# Altium schematic sheet OMT_Speaker_Pwm.SchDoc
size A; Organization: Altium Limited; Address1: L3, 12a Rodborough Rd; Address2: Frenchs Forest; Address3: NSW; Address4: Australia 2086; DocumentNumber: 4; SheetNumber: 4; SheetTotal: 5
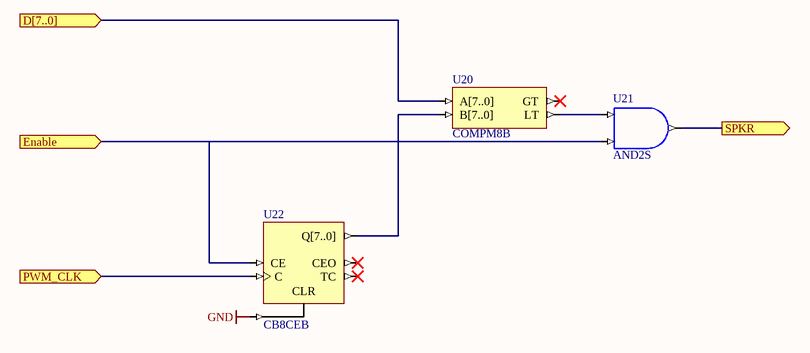
[diagram p0: OMT_Speaker_Pwm.SchDoc]

## Parts
U20  COMPM8B
U21  AND2S
U22  CB8CEB

## Ports
D[7..0] (in), Enable (in), PWM_CLK (in), SPKR (out)

## Nets
GND: U22.CLR
D[7..0]: U20.A[7..0] ; port D[7..0]
Enable: U21.I1 U22.CE ; port Enable
PWM_CLK: U22.C ; port PWM_CLK
SPKR: U21.O ; port SPKR
NetU20_B[7..0]: U20.B[7..0] U22.Q[7..0]
NetU20_LT: U20.LT U21.I0

Not connected (* = marked no-connect by the designer): U20 GT*; U22 CEO* TC*

## Notes on the sheet
- Title
- Size:
- Date:
- A
- Number:
- Time:
- Revision:
- Sheet
- of
- File:

## Library data of the parts
U20 = COMPM8B: 8-Bit Magnitude Comparator, Bus Version; Xilinx Equivalent: COMPM8; ArchiveName: GENERIC; Published: 7-Nov-2003; Publisher: Altium Limited; Core Revision: 1.00.00
U21 = AND2S: 2-Input AND Gate, Single Pin Version; Xilinx Equivalent: AND2; ArchiveName: GENERIC; Published: 7-Nov-2003; Publisher: Altium Limited; Core Revision: 1.00.00
U22 = CB8CEB: 8-Bit Cascadable Binary Counters with Clock Enable and Asynchronous Clear, Bus Version; Xilinx Equivalent: CB8CE; ArchiveName: GENERIC; Published: 7-Nov-2003; Publisher: Altium Limited; Core Revision: 1.00.00